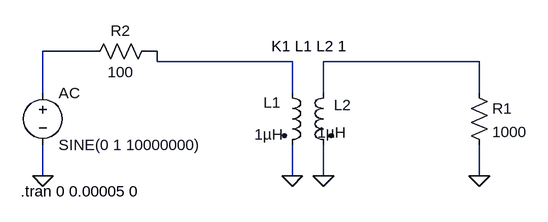
[diagram p0: schematic Draft1.asc]
Draft1.asc, the LTspice schematic file:
Version 4
SHEET 1 880 680
WIRE 32 32 -48 32
WIRE 128 32 112 32
WIRE 128 48 128 32
WIRE 336 48 128 48
WIRE 624 48 384 48
WIRE -48 96 -48 32
WIRE 336 96 336 48
WIRE 384 96 384 48
WIRE 624 96 624 48
WIRE -48 224 -48 176
WIRE 336 224 336 176
WIRE 384 224 384 176
WIRE 624 224 624 176
FLAG 336 224 0
FLAG -48 224 0
FLAG 384 224 0
FLAG 624 224 0
SYMBOL voltage -48 80 R0
WINDOW 123 0 0 Left 2
WINDOW 39 24 124 Left 2
SYMATTR InstName AC
SYMATTR Value SINE(0 1 10000000)
SYMBOL ind2 320 80 R0
WINDOW 0 -28 31 Left 2
WINDOW 3 -42 80 Left 2
SYMATTR InstName L1
SYMATTR Value 1µH
SYMATTR Type ind
SYMBOL res 608 80 R0
SYMATTR InstName R1
SYMATTR Value 1000
SYMBOL ind2 400 80 M0
WINDOW 0 -27 35 Left 2
WINDOW 3 -19 77 Left 2
SYMATTR InstName L2
SYMATTR Value 1µH
SYMATTR Type ind
SYMBOL res 128 16 R90
WINDOW 0 0 56 VBottom 2
WINDOW 3 32 56 VTop 2
SYMATTR InstName R2
SYMATTR Value 100
TEXT 304 24 Left 2 !K1 L1 L2 1
TEXT -82 248 Left 2 !.tran 0 0.00005 0

The netlist it stands for:
* Draft1.asc
V§AC N001 0 SINE(0 1 10000000)
L1 N002 0 1µH
R1 N003 0 1000
L2 N003 0 1µH
R2 N002 N001 100
K1 L1 L2 1
.tran 0 0.00005 0
.backanno
.end